# Altium schematic sheet uc1A.SchDoc: Microcontroller 1 (Part A)
size A4; Author: Marcel Hellwig; Organization: Hamburg Bit-Bots; Address1: Vogt-Kölln-Str. 30; Address2: 22527 Hamburg; Address3: Germany; Address4: www.bit-bots.de; DocumentNumber: 3; Revision: A; SheetNumber: 3; SheetTotal: 16; EMail: info@bit-bots.de
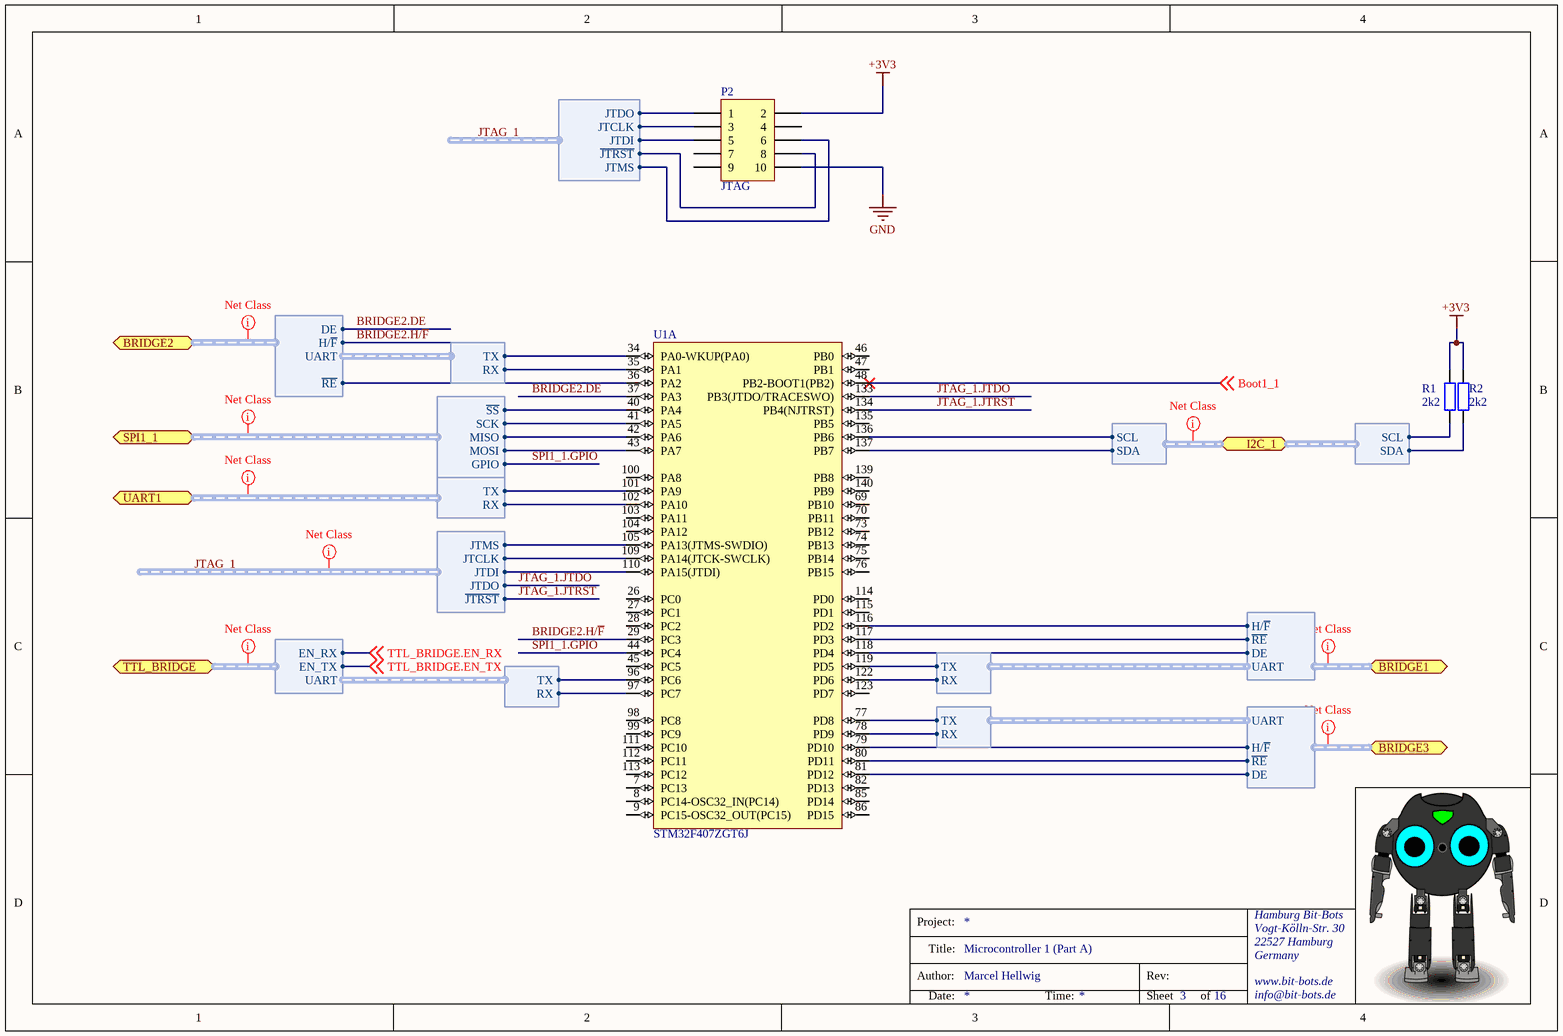
[diagram p0: uc1A.SchDoc]

## Parts
P2  JTAG  [HDR2X5]  (no BOM)
R1  2k2  [R2012]
R2  2k2  [R2012]
U1  STM32F407ZGT6J  [STM-LQFP144_M]  (part A of 3)

## Ports
BRIDGE1 (harness UART_RS485), BRIDGE2 (harness UART_RS485), BRIDGE3 (harness UART_RS485), I2C_1 (harness I²C), SPI1_1 (harness SPI), TTL_BRIDGE (harness TTL), UART1 (harness UART)

## Harnesses
UART: TX, RX
SPI: ~{SS}, SCK, MISO, MOSI, GPIO
I²C: SCL, SDA
UART_RS485: UART, DE, ~{RE}, H/~{F}
UART_RS485: ~{RE}, UART, DE, H/~{F}
JTAG: ~{JTRST}, JTCLK, JTDI, JTDO, JTMS
TTL: UART, EN_TX, EN_RX

## Nets
+3V3: P2.2 R1.1 R2.2
GND: P2.10
Boot1_1: U1.48(PB2-BOOT1(PB2)) ; off-sheet Boot1_1
BRIDGE2.DE: U1.37(PA3) ; port BRIDGE2.DE
BRIDGE2.H/~{F}: U1.29(PC3) ; port BRIDGE2.H/~{F}
JTAG_1~{.}JTRST: P2.8 U1.134(PB4(NJTRST)) ; harness JTAG.~{JTRST}
JTAG_1.JTCLK: P2.3 U1.109(PA14(JTCK-SWCLK)) ; harness JTAG.JTCLK
JTAG_1.JTDI: P2.5 U1.110(PA15(JTDI)) ; harness JTAG.JTDI
JTAG_1.JTDO: P2.1 U1.133(PB3(JTDO/TRACESWO)) ; harness JTAG.JTDO
JTAG_1.JTMS: P2.6 U1.105(PA13(JTMS-SWDIO)) ; harness JTAG.JTMS
SPI1_1.GPIO: U1.44(PC4) ; port SPI1_1.GPIO
TTL_BRIDGE.EN_RX: off-sheet TTL_BRIDGE.EN_RX, port TTL_BRIDGE.EN_RX
TTL_BRIDGE.EN_TX: off-sheet TTL_BRIDGE.EN_TX, port TTL_BRIDGE.EN_TX
NetR1_2: R1.2 U1.136(PB6) ; port I2C_1.SCL
NetR2_1: R2.1 U1.137(PB7) ; port I2C_1.SDA
NetU1_34: U1.34(PA0-WKUP(PA0)) ; harness UART.TX
NetU1_35: U1.35(PA1) ; harness UART.RX
NetU1_36: U1.36(PA2) ; port BRIDGE2.~{RE}
NetU1_40: U1.40(PA4) ; port SPI1_1.~{SS}
NetU1_41: U1.41(PA5) ; port SPI1_1.SCK
NetU1_42: U1.42(PA6) ; port SPI1_1.MISO
NetU1_43: U1.43(PA7) ; port SPI1_1.MOSI
NetU1_77: U1.77(PD8) ; harness UART.TX
NetU1_78: U1.78(PD9) ; harness UART.RX
NetU1_79: U1.79(PD10) ; port BRIDGE3.H/~{F}
NetU1_80: U1.80(PD11) ; port BRIDGE3.~{RE}
NetU1_81: U1.81(PD12) ; port BRIDGE3.DE
NetU1_96: U1.96(PC6) ; harness UART.TX
NetU1_97: U1.97(PC7) ; harness UART.RX
NetU1_101: U1.101(PA9) ; port UART1.TX
NetU1_102: U1.102(PA10) ; port UART1.RX
NetU1_116: U1.116(PD2) ; port BRIDGE1.H/~{F}
NetU1_117: U1.117(PD3) ; port BRIDGE1.~{RE}
NetU1_118: U1.118(PD4) ; port BRIDGE1.DE
NetU1_119: U1.119(PD5) ; harness UART.TX
NetU1_122: U1.122(PD6) ; harness UART.RX

Not connected (* = marked no-connect by the designer): P2 4 7 9; U1 7(PC13) 8(PC14-OSC32_IN(PC14)) 9(PC15-OSC32_OUT(PC15)) 26(PC0) 27(PC1) 28(PC2) 45(PC5) 46(PB0) 47(PB1) 69(PB10) 70(PB11) 73(PB12) 74(PB13) 75(PB14) 76(PB15) 82(PD13) 85(PD14) 86(PD15) 98(PC8) 99(PC9) 100(PA8) 103(PA11) 104(PA12) 111(PC10) 112(PC11) 113(PC12) 114(PD0) 115(PD1) 123(PD7) 135(PB5) 139(PB8) 140(PB9)

## Layout directives
net class I2C: (no net found under the mark)
net class UART; net class Bridge2: (no net found under the mark)
net class SPI; net class SPI1: (no net found under the mark)
net class UART; net class UART1: (no net found under the mark)
net class UART; net class Bridge1: (no net found under the mark)
net class UART; net class Bridge3: (no net found under the mark)
net class JTAG: (no net found under the mark)
net class TTL: (no net found under the mark)

## Notes on the sheet
- Project:
- Author:
- Title:
- Rev:
- Date:
- Time:
- Sheet
- of

## Library data of the parts
P2 = Header 5X2: Header, 5-Pin, Dual row; LatestRevisionDate: 17-Jul-2002; LatestRevisionNote: Re-released for DXP Platform.; Publisher: Altium Limited
R1 R2 = Res2: Resistor; Manufacturer: MULTICOMP; Manufacturer Part Number: MCMR08X2201FTL; Produktpalette: Baureihe MCMR; Widerstand: 2.2; Nennleistung: 125; Widerstandstoleranz: ±1%; Bauform: 0805 [Metrisch 2012]; Widerstandselement: Keramik; Temperaturkoeffizient: ±100; Nennspannung: 150; Verpackung: Gurtabschnitt; SVHC: No SVHC (17-Dec-2014); Widerstandsmontage: Oberflächenmontage<!--FANDB--><div class="features-and-benefits-container"></div>; Published: 8-Jun-2000; LatestRevisionDate: 17-Jul-2002; LatestRevisionNote: Re-released for DXP Platform.; PackageReference: AXIAL-0.4; Publisher: Altium Limited; PackageDescription: Axial Device, Thru-Hole; 2 Leads; 0.4 in Pin Spacing; Value: 2k2; Supplier 1: Farnell; Supplier Part Number 1: 2073690; RoHS: YES; Stock 1: 38600; Pricing 1: 100=0,014, 500=0,011, 1000=0,01 (EUR); MSL: -; ComponentLink1URL: http://www.farnell.com/datasheets/1716708.pdf; ComponentLink1Description: http://www.farnell.com/datasheets/1716708.pdf
U1 = CMP-0243-00063-2: ARM Cortex-M4 32-bit MCU+FPU, 210 DMIPS, 1024 kB Flash, 192 kB Internal RAM, 114 I/Os, 144-pin LQFP, -40 to 85 degC, Tray; Manufacturer: STMicroelectronics; I/Os (High Current): 114; D/A Converter: 2x12-bit; Internal RAM Size (kB): 192; Operating Frequency(F) (Processor speed) (MHz): 168; Supply Voltage(Vcc) max (V): 3.6; Supply Voltage(Vcc) min (V): 1.8; FLASH Size (Prog) (kB): 1024; ComponentLink3Description: Package Specification; PackageVersion: Rev. 4, 06/2013; PartNumber: STM32F407ZGT6J; ComponentLink3URL: http://www.st.com/st-web-ui/static/active/en/resource/technical/document/datasheet/DM00037051.pdf; PackageReference: LQFP144; ComponentLink2URL: http://www.st.com/st-web-ui/static/active/en/resource/technical/document/datasheet/DM00037051.pdf; ComponentLink2Description: Datasheet; ComponentLink1Description: Manufacturer URL; Mounting Technology: Surface Mount; Core: ARM Cortex-M4; PackageDescription: 144-Pin Low Profile Quad Flat Package, 20 x 20 mm Body, 0.5 mm Pitch; Packing: Tray; ComponentLink1URL: http://www.st.com/web/en/home.html; DatasheetVersion: Rev. 4; PartId: 1; Supplier 1: Farnell; Supplier Part Number 1: 2333299